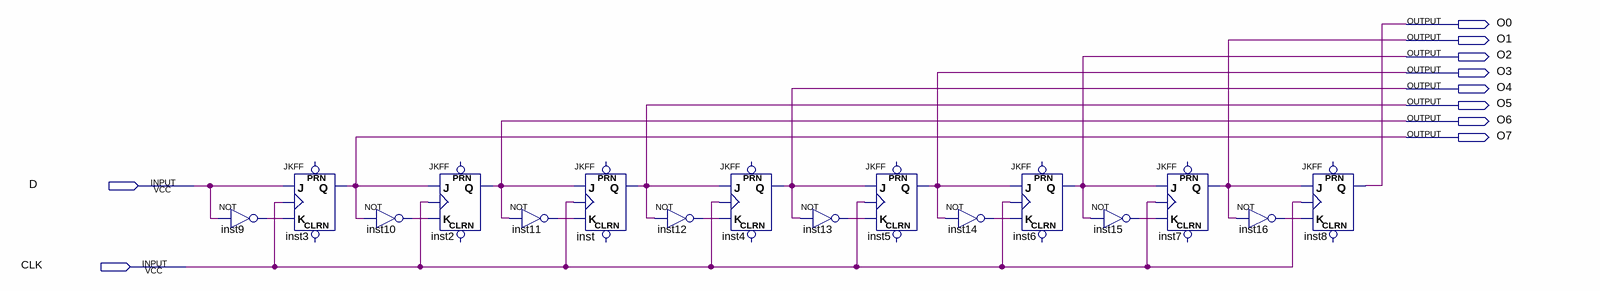
[diagram p0: schematic sheet]
// Quartus schematic SIPOregister.bdf as structural Verilog: 16 symbols, 10 pins
module SIPOregister (
  input  D,
  input  CLK,
  output O0,
  output O1,
  output O2,
  output O3,
  output O4,
  output O5,
  output O6,
  output O7
);

  wire inst9_out, inst10_out, inst11_out, inst12_out, inst13_out, inst14_out, inst15_out, inst16_out;

  not inst9 (inst9_out, D);
  JKFF inst3 (.K(inst9_out), .J(D), .CLK(CLK), .Q(O7));  // open: PRN, CLRN
  not inst10 (inst10_out, O7);
  JKFF inst2 (.K(inst10_out), .J(O7), .CLK(CLK), .Q(O6));  // open: PRN, CLRN
  not inst11 (inst11_out, O6);
  JKFF inst (.K(inst11_out), .J(O6), .CLK(CLK), .Q(O5));  // open: PRN, CLRN
  not inst12 (inst12_out, O5);
  JKFF inst4 (.K(inst12_out), .J(O5), .CLK(CLK), .Q(O4));  // open: PRN, CLRN
  not inst13 (inst13_out, O4);
  JKFF inst5 (.K(inst13_out), .J(O4), .CLK(CLK), .Q(O3));  // open: PRN, CLRN
  not inst14 (inst14_out, O3);
  JKFF inst6 (.K(inst14_out), .J(O3), .CLK(CLK), .Q(O2));  // open: PRN, CLRN
  not inst15 (inst15_out, O2);
  JKFF inst7 (.K(inst15_out), .J(O2), .CLK(CLK), .Q(O1));  // open: PRN, CLRN
  not inst16 (inst16_out, O1);
  JKFF inst8 (.K(inst16_out), .J(O1), .CLK(CLK), .Q(O0));  // open: PRN, CLRN
endmodule
